# Altium schematic sheet PowerBoard.SchDoc
size A4; SheetNumber: 1; SheetTotal: 1
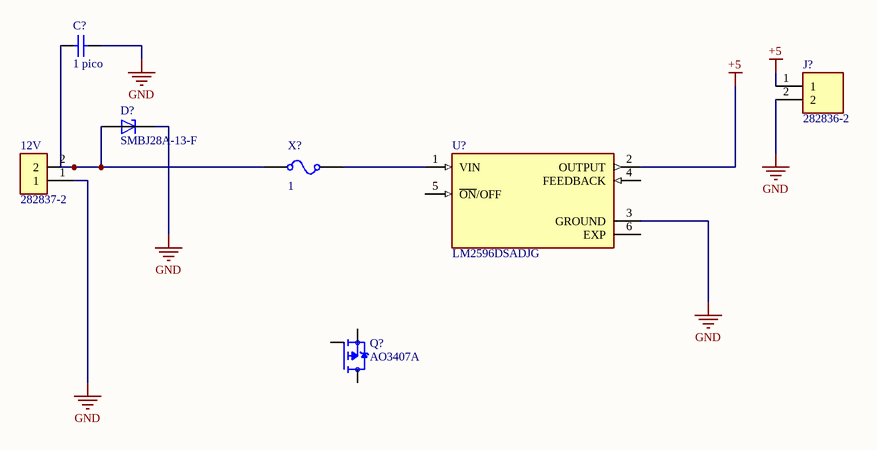
[diagram p0: PowerBoard.SchDoc]

## Parts
12V  282837-2  [TE_282837-2]
C?  value 1 pico  (hidden comment: Capacitor)
D?  SMBJ28A-13-F  [DIOM5336X250N]
J?  282836-2  [TE_282836-2]
Q?  AO3407A  [SOT95P280X125-3N]
U?  LM2596DSADJG  [CONV_LM2596DSADJG]
X?  CURRENT: 1  (hidden comment: Fuse)

## Nets
+5: J?.1 U?.2(OUTPUT)
GND: 12V.1 C?.2 D?.1(C) J?.2 U?.3(GROUND)
Net12V_2: 12V.2 C?.1 D?.2(A) X?.1
NetU?_1: U?.1(VIN) X?.2

Not connected (* = marked no-connect by the designer): Q? 1(G) 2(S) 3(D); U? 4(FEEDBACK) 5(~{ON}/OFF) 6(EXP)

## Library data of the parts
12V = 282837-2: Ð Ð°Ð·ÑŠÐµÐ¼Ð½Ñ‹Ðµ ÐºÐ»ÐµÐ¼Ð¼Ð½Ñ‹Ðµ ÐºÐ¾Ð»Ð¾Ð´ÐºÐ¸ Ð Ð¾Ð·ÐµÑ‚ÐºÐ° 2 Ð¿Ð¾Ð»Ð¾Ð¶ÐµÐ½Ð¸Ñ 5,08 Ð¼Ð¼ ÐŸÑ€Ð¸Ð¿Ð¾Ð¹ Ð¿Ñ€ÑÐ¼Ð¾Ð¹ Ñ‡ÐµÑ€ÐµÐ· Ð¾Ñ‚Ð²ÐµÑ€ÑÑ‚Ð¸Ðµ 13,5 Ð / ÐºÐ¾Ð½Ñ‚Ð°ÐºÑ‚; MF: TE Connectivity; SnapEDA_Link: https://www.snapeda.com/parts/282837-2/TE+Connectivity+AMP+Connectors/view-part/?ref=snap; Price: None; Check_prices: https://www.snapeda.com/parts/282837-2/TE+Connectivity+AMP+Connectors/view-part/?ref=eda; Purchase-URL: https://pricing.snapeda.com/search/part/282837-2/?ref=eda; MP: 282837-2; Value: *; Availability: In Stock; Package: None
C? = Capacitor: SimulationGenericComponent: True
D? = SMBJ28A-13-F: MF: {'manufacturer': u'Diodes Incorporated'}; Package: None; Price: None; Value: *; MP: SMBJ28A-13-F; Availability: Unavailable
J? = 282836-2: Connector, Terminal Block; Wire Receptacle; 2 Pos.; 16-30 AWG; 0.197 in. CL; Sid; MF: TE Connectivity; Purchase-URL: https://pricing.snapeda.com/search/part/282836-2/?ref=eda; Value: *; MP: 282836-2; Package: None; Check_prices: https://www.snapeda.com/parts/282836-2/TE+Connectivity+AMP+Connectors/view-part/?ref=eda; Price: None; SnapEDA_Link: https://www.snapeda.com/parts/282836-2/TE+Connectivity+AMP+Connectors/view-part/?ref=snap; Availability: In Stock
Q? = AO3407A: P-Channel 30 V 4.3A (Ta) 1.4W (Ta) Surface Mount SOT-23-3; MF: Alpha &; SnapEDA_Link: https://www.snapeda.com/parts/AO3407A/Alpha/view-part/?ref=snap; Package: SOT-23 Alpha &amp; Omega Semiconductor; Value: *; MP: AO3407A; Check_prices: https://www.snapeda.com/parts/AO3407A/Alpha/view-part/?ref=eda
U? = LM2596DSADJG: LM2596DSADJG Switching Regulator 3A Adjustable, 1.23 to 37 V, 5-Pin D2PAK | ON Semiconductor LM2596DSADJG; SnapEDA_Link: https://www.snapeda.com/parts/LM2596DSADJG/Onsemi/view-part/?ref=snap; Package: D2PAK-5 ON Semiconductor; Value: *; MF: ON Semiconductor; MP: LM2596DSADJG; Check_prices: https://www.snapeda.com/parts/LM2596DSADJG/Onsemi/view-part/?ref=eda
X? = Fuse: RESISTANCE: 1m; SimulationGenericComponent: True